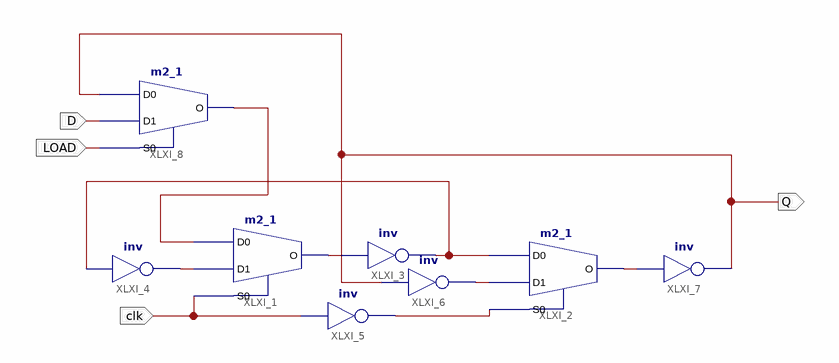
[diagram p0: schematic sheet 1]
// Xilinx ISE schematic D_flip_flop_1_bit.sch (virtex6) as structural Verilog: 8 symbols, 4 ports
module D_flip_flop_1_bit (
  input  clk,
  input  D,
  input  LOAD,
  output Q
);

  wire XLXN_3, XLXN_5, XLXN_6, XLXN_7, XLXN_8, XLXN_11, XLXN_15;

  m2_1 XLXI_1 (.D0(XLXN_15), .D1(XLXN_5), .S0(clk), .O(XLXN_3));
  m2_1 XLXI_2 (.D0(XLXN_8), .D1(XLXN_6), .S0(XLXN_11), .O(XLXN_7));
  not XLXI_3 (XLXN_8, XLXN_3);
  not XLXI_4 (XLXN_5, XLXN_8);
  not XLXI_5 (XLXN_11, clk);
  not XLXI_6 (XLXN_6, Q);
  not XLXI_7 (Q, XLXN_7);
  m2_1 XLXI_8 (.D0(Q), .D1(D), .S0(LOAD), .O(XLXN_15));
endmodule
